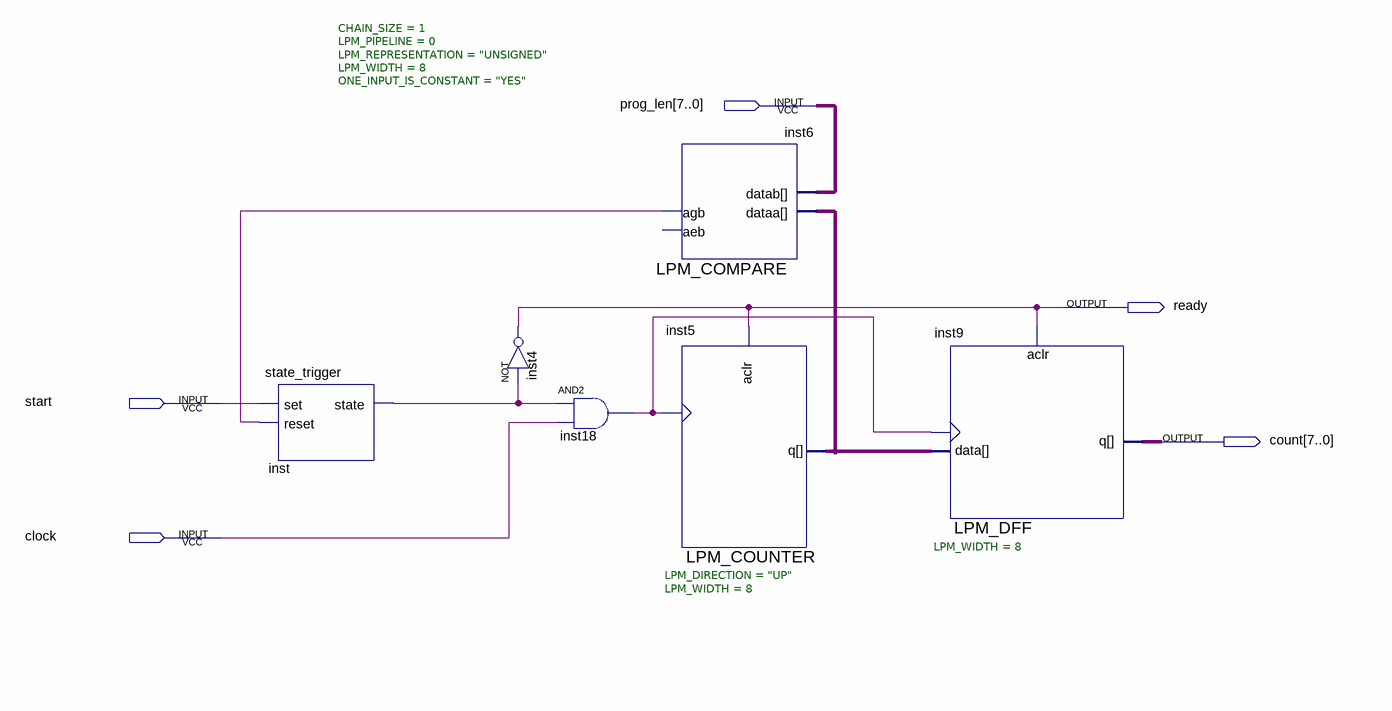
[diagram p0: schematic sheet]
// Quartus schematic iterator.bdf as structural Verilog: 6 symbols, 5 pins
module iterator (
  input  [7:0] prog_len,
  input  start,
  input  clock,
  output ready,
  output [7:0] count
);

  wire inst6_agb, inst18_out, inst_state;
  wire [7:0] inst5_q;

  state_trigger inst (.set(start), .reset(inst6_agb), .state(inst_state));
  not inst4 (ready, inst_state);
  and inst18 (inst18_out, inst_state, clock);
  LPM_COMPARE #(.CHAIN_SIZE(1), .LPM_PIPELINE(0), .LPM_REPRESENTATION("UNSIGNED"), .LPM_WIDTH(8), .ONE_INPUT_IS_CONSTANT("YES")) inst6 (
    .dataa(inst5_q), .datab(prog_len), .agb(inst6_agb));  // open: aeb
  LPM_COUNTER #(.LPM_DIRECTION("UP"), .LPM_WIDTH(8)) inst5 (.clock(inst18_out), .aclr(ready), .q(inst5_q));
  LPM_DFF #(.LPM_WIDTH(8)) inst9 (.clock(inst18_out), .data(inst5_q), .aclr(ready), .q(count));
endmodule
